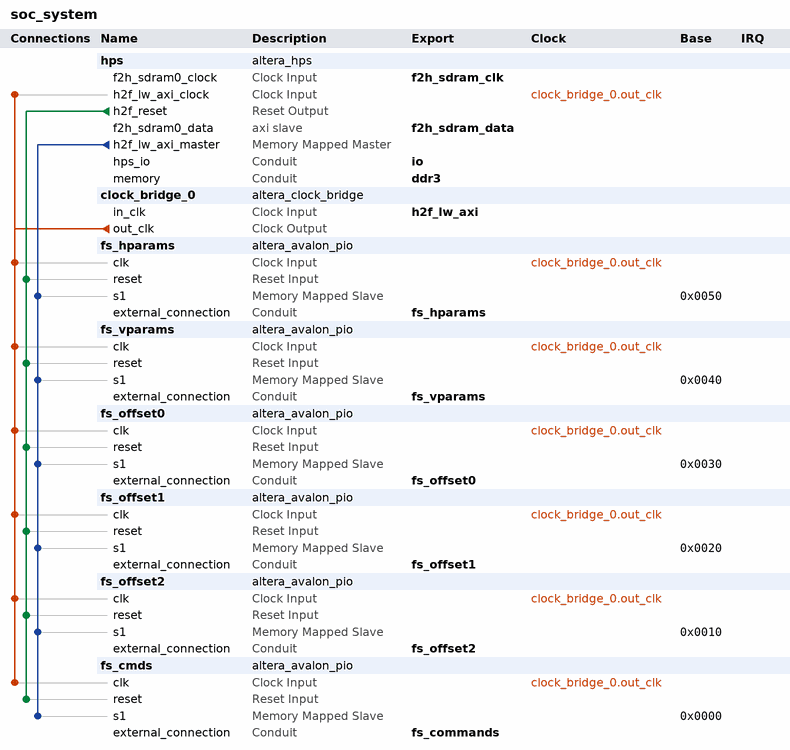
[diagram p0: system contents]
# Platform Designer (Qsys) system soc_system, Cyclone V 5CSEBA6U23I7
# Parameters at their usual value, and those the tool derives, are not listed.
package require -exact qsys 16.1
create_system soc_system
set_project_property DEVICE_FAMILY {Cyclone V}
set_project_property DEVICE 5CSEBA6U23I7

add_instance hps altera_hps 16.1
set_instance_parameter_value hps EMAC1_Mode RGMII
set_instance_parameter_value hps EMAC1_PinMuxing {HPS I/O Set 0}
set_instance_parameter_value hps F2SCLK_COLDRST_Enable false
set_instance_parameter_value hps F2SCLK_DBGRST_Enable false
set_instance_parameter_value hps F2SCLK_WARMRST_Enable false
set_instance_parameter_value hps F2SDRAM_Type AXI-3
set_instance_parameter_value hps F2SDRAM_Width 256
set_instance_parameter_value hps F2SINTERRUPT_Enable false
set_instance_parameter_value hps F2S_Width 0
set_instance_parameter_value hps FPGA_PERIPHERAL_OUTPUT_CLOCK_FREQ_EMAC0_GTX_CLK 100
set_instance_parameter_value hps FPGA_PERIPHERAL_OUTPUT_CLOCK_FREQ_EMAC0_MD_CLK 100.0
set_instance_parameter_value hps FPGA_PERIPHERAL_OUTPUT_CLOCK_FREQ_EMAC1_GTX_CLK 100
set_instance_parameter_value hps FPGA_PERIPHERAL_OUTPUT_CLOCK_FREQ_EMAC1_MD_CLK 100.0
set_instance_parameter_value hps HPS_PROTOCOL DDR3
set_instance_parameter_value hps I2C0_Mode I2C
set_instance_parameter_value hps I2C0_PinMuxing {HPS I/O Set 0}
set_instance_parameter_value hps I2C1_Mode I2C
set_instance_parameter_value hps I2C1_PinMuxing {HPS I/O Set 0}
set_instance_parameter_value hps LWH2F_Enable true
set_instance_parameter_value hps MEM_BANKADDR_WIDTH 3
set_instance_parameter_value hps MEM_CLK_FREQ 400.0
set_instance_parameter_value hps MEM_COL_ADDR_WIDTH 10
set_instance_parameter_value hps MEM_DQ_WIDTH 32
set_instance_parameter_value hps MEM_DRV_STR RZQ/6
set_instance_parameter_value hps MEM_ROW_ADDR_WIDTH 15
set_instance_parameter_value hps MEM_RTT_NOM RZQ/6
set_instance_parameter_value hps MEM_RTT_WR {Dynamic ODT off}
set_instance_parameter_value hps MEM_TCL 7
set_instance_parameter_value hps MEM_TFAW_NS 37.5
set_instance_parameter_value hps MEM_TRAS_NS 35.0
set_instance_parameter_value hps MEM_TRCD_NS 13.75
set_instance_parameter_value hps MEM_TRFC_NS 300.0
set_instance_parameter_value hps MEM_TRP_NS 13.75
set_instance_parameter_value hps MEM_VENDOR Other
set_instance_parameter_value hps MEM_WTCL 7
set_instance_parameter_value hps QSPI_Mode N/A
set_instance_parameter_value hps QSPI_PinMuxing Unused
set_instance_parameter_value hps REF_CLK_FREQ 25.0
set_instance_parameter_value hps S2FCLK_USER2CLK 4
set_instance_parameter_value hps S2F_Width 0
set_instance_parameter_value hps SDIO_Mode {4-bit Data}
set_instance_parameter_value hps SDIO_PinMuxing {HPS I/O Set 0}
set_instance_parameter_value hps SPIM1_Mode {Single Slave Select}
set_instance_parameter_value hps SPIM1_PinMuxing {HPS I/O Set 0}
set_instance_parameter_value hps STM_Enable false
set_instance_parameter_value hps TIMING_BOARD_AC_SKEW 0.02
set_instance_parameter_value hps TIMING_BOARD_AC_TO_CK_SKEW 0.0
set_instance_parameter_value hps TIMING_BOARD_DQ_TO_DQS_SKEW 0.0
set_instance_parameter_value hps TIMING_BOARD_MAX_CK_DELAY 0.6
set_instance_parameter_value hps TIMING_BOARD_MAX_DQS_DELAY 0.6
set_instance_parameter_value hps TIMING_BOARD_SKEW_BETWEEN_DQS 0.02
set_instance_parameter_value hps TIMING_BOARD_SKEW_CKDQS_DIMM_MAX 0.01
set_instance_parameter_value hps TIMING_BOARD_SKEW_CKDQS_DIMM_MIN -0.01
set_instance_parameter_value hps TIMING_BOARD_SKEW_WITHIN_DQS 0.02
set_instance_parameter_value hps TIMING_TDH 125
set_instance_parameter_value hps TIMING_TDQSCK 400
set_instance_parameter_value hps TIMING_TDQSQ 120
set_instance_parameter_value hps TIMING_TDS 50
set_instance_parameter_value hps TIMING_TIH 250
set_instance_parameter_value hps TIMING_TIS 175
set_instance_parameter_value hps TIMING_TQSH 0.38
set_instance_parameter_value hps UART0_Mode {No Flow Control}
set_instance_parameter_value hps UART0_PinMuxing {HPS I/O Set 0}
set_instance_parameter_value hps USB1_Mode SDR
set_instance_parameter_value hps USB1_PinMuxing {HPS I/O Set 0}
set_instance_parameter_value hps desired_cfg_clk_mhz 100.0
set_instance_parameter_value hps desired_qspi_clk_mhz 370.0

add_instance clock_bridge_0 altera_clock_bridge 16.1
set_instance_parameter_value clock_bridge_0 DERIVED_CLOCK_RATE 0
set_instance_parameter_value clock_bridge_0 EXPLICIT_CLOCK_RATE 0

add_instance fs_hparams altera_avalon_pio 16.1
set_instance_parameter_value fs_hparams direction Output
set_instance_parameter_value fs_hparams width 32

add_instance fs_vparams altera_avalon_pio 16.1
set_instance_parameter_value fs_vparams direction Output
set_instance_parameter_value fs_vparams width 32

add_instance fs_offset0 altera_avalon_pio 16.1
set_instance_parameter_value fs_offset0 direction Output
set_instance_parameter_value fs_offset0 width 32

add_instance fs_offset1 altera_avalon_pio 16.1
set_instance_parameter_value fs_offset1 direction Output
set_instance_parameter_value fs_offset1 width 32

add_instance fs_offset2 altera_avalon_pio 16.1
set_instance_parameter_value fs_offset2 direction Output
set_instance_parameter_value fs_offset2 width 32

add_instance fs_cmds altera_avalon_pio 16.1
set_instance_parameter_value fs_cmds direction Output
set_instance_parameter_value fs_cmds width 4

# connections
add_connection clock_bridge_0.out_clk fs_cmds.clk clock
add_connection clock_bridge_0.out_clk fs_hparams.clk clock
add_connection clock_bridge_0.out_clk fs_offset0.clk clock
add_connection clock_bridge_0.out_clk fs_offset1.clk clock
add_connection clock_bridge_0.out_clk fs_offset2.clk clock
add_connection clock_bridge_0.out_clk fs_vparams.clk clock
add_connection clock_bridge_0.out_clk hps.h2f_lw_axi_clock clock
add_connection hps.h2f_reset fs_cmds.reset reset
add_connection hps.h2f_reset fs_hparams.reset reset
add_connection hps.h2f_reset fs_offset0.reset reset
add_connection hps.h2f_reset fs_offset1.reset reset
add_connection hps.h2f_reset fs_offset2.reset reset
add_connection hps.h2f_reset fs_vparams.reset reset
add_connection hps.h2f_lw_axi_master fs_cmds.s1 avalon
set_connection_parameter_value hps.h2f_lw_axi_master/fs_cmds.s1 baseAddress 0x0000
add_connection hps.h2f_lw_axi_master fs_hparams.s1 avalon
set_connection_parameter_value hps.h2f_lw_axi_master/fs_hparams.s1 baseAddress 0x0050
add_connection hps.h2f_lw_axi_master fs_offset0.s1 avalon
set_connection_parameter_value hps.h2f_lw_axi_master/fs_offset0.s1 baseAddress 0x0030
add_connection hps.h2f_lw_axi_master fs_offset1.s1 avalon
set_connection_parameter_value hps.h2f_lw_axi_master/fs_offset1.s1 baseAddress 0x0020
add_connection hps.h2f_lw_axi_master fs_offset2.s1 avalon
set_connection_parameter_value hps.h2f_lw_axi_master/fs_offset2.s1 baseAddress 0x0010
add_connection hps.h2f_lw_axi_master fs_vparams.s1 avalon
set_connection_parameter_value hps.h2f_lw_axi_master/fs_vparams.s1 baseAddress 0x0040

# exported interfaces
add_interface ddr3 conduit end
set_interface_property ddr3 EXPORT_OF hps.memory
add_interface f2h_sdram_clk clock sink
set_interface_property f2h_sdram_clk EXPORT_OF hps.f2h_sdram0_clock
add_interface f2h_sdram_data axi slave
set_interface_property f2h_sdram_data EXPORT_OF hps.f2h_sdram0_data
add_interface fs_commands conduit end
set_interface_property fs_commands EXPORT_OF fs_cmds.external_connection
add_interface fs_hparams conduit end
set_interface_property fs_hparams EXPORT_OF fs_hparams.external_connection
add_interface fs_offset0 conduit end
set_interface_property fs_offset0 EXPORT_OF fs_offset0.external_connection
add_interface fs_offset1 conduit end
set_interface_property fs_offset1 EXPORT_OF fs_offset1.external_connection
add_interface fs_offset2 conduit end
set_interface_property fs_offset2 EXPORT_OF fs_offset2.external_connection
add_interface fs_vparams conduit end
set_interface_property fs_vparams EXPORT_OF fs_vparams.external_connection
add_interface h2f_lw_axi clock sink
set_interface_property h2f_lw_axi EXPORT_OF clock_bridge_0.in_clk
add_interface io conduit end
set_interface_property io EXPORT_OF hps.hps_io

set_interconnect_requirement {$system} qsys_mm.clockCrossingAdapter HANDSHAKE
set_interconnect_requirement {$system} qsys_mm.maxAdditionalLatency 1

save_system soc_system.qsys
